# Altium schematic sheet Labels.SchDoc
size Letter; DocumentNumber: 10; SheetNumber: 10; SheetTotal: 11; Pagesize: Letter
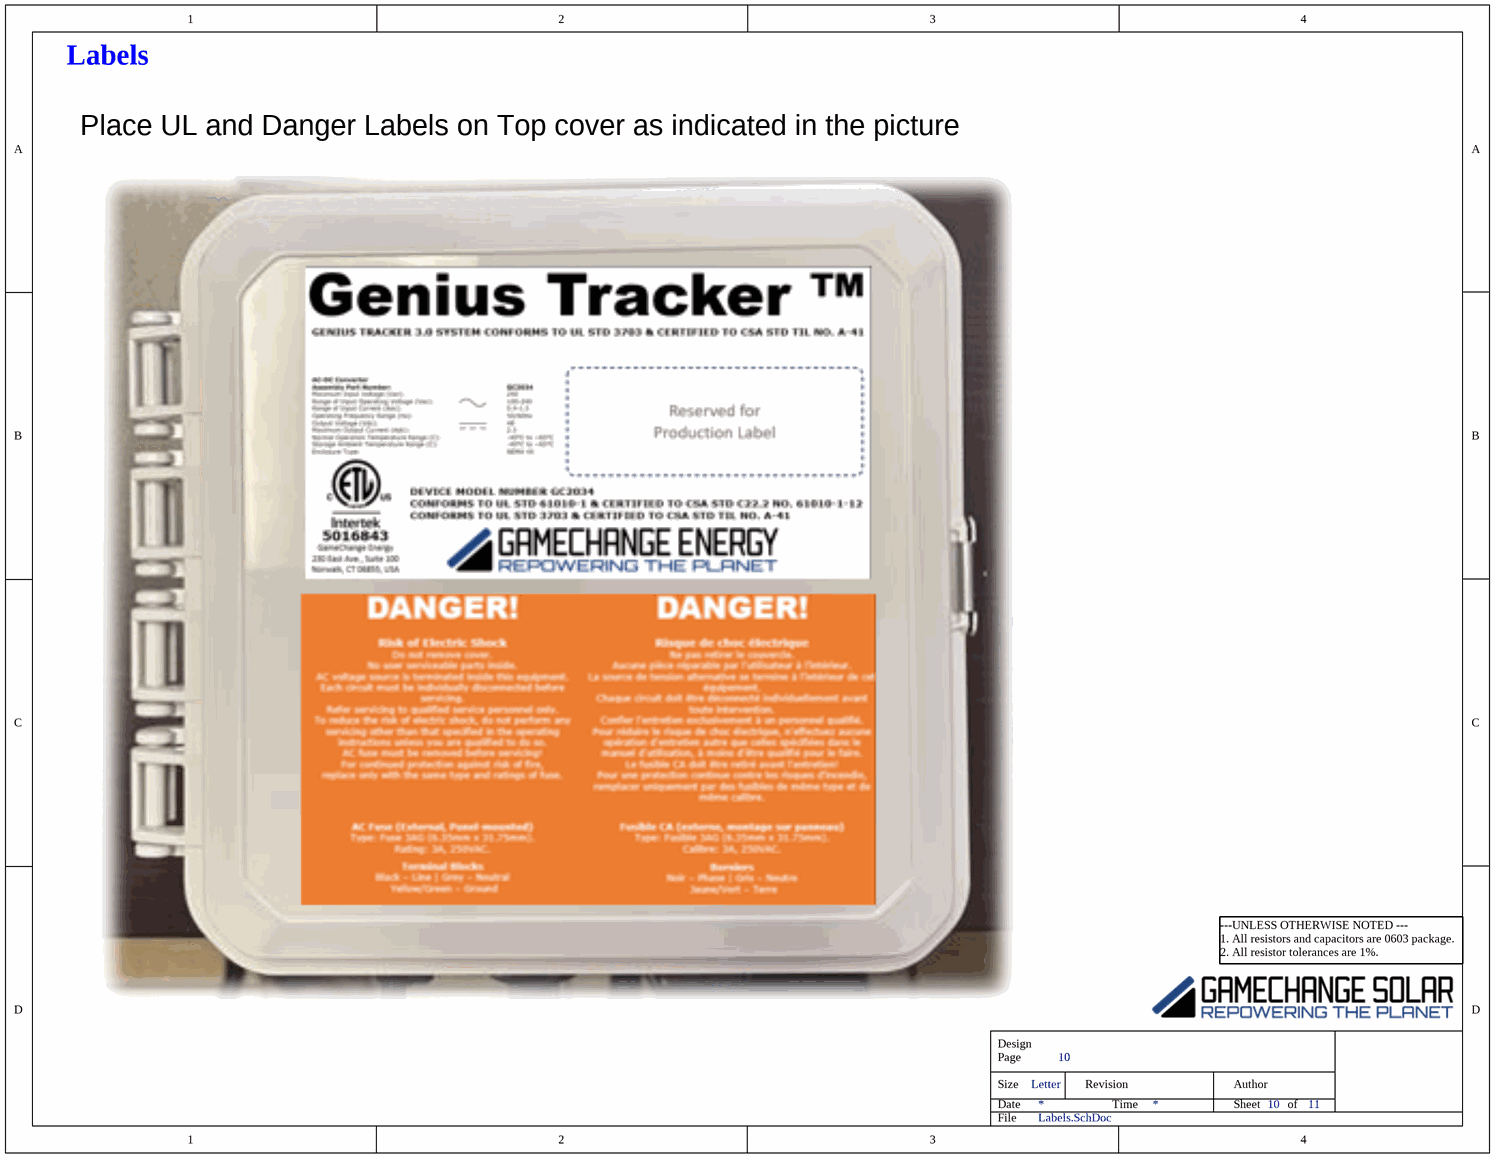
[diagram p0: Labels.SchDoc]

## Notes on the sheet
- Labels
- Place UL and Danger Labels on Top cover as indicated in the picture
- ---UNLESS OTHERWISE NOTED ---
  1. All resistors and capacitors are 0603 package.
  2. All resistor tolerances are 1%.
- Design
- Size
- Date
- Page
- Revision
- Time
- Sheet
- Author
- of
- File